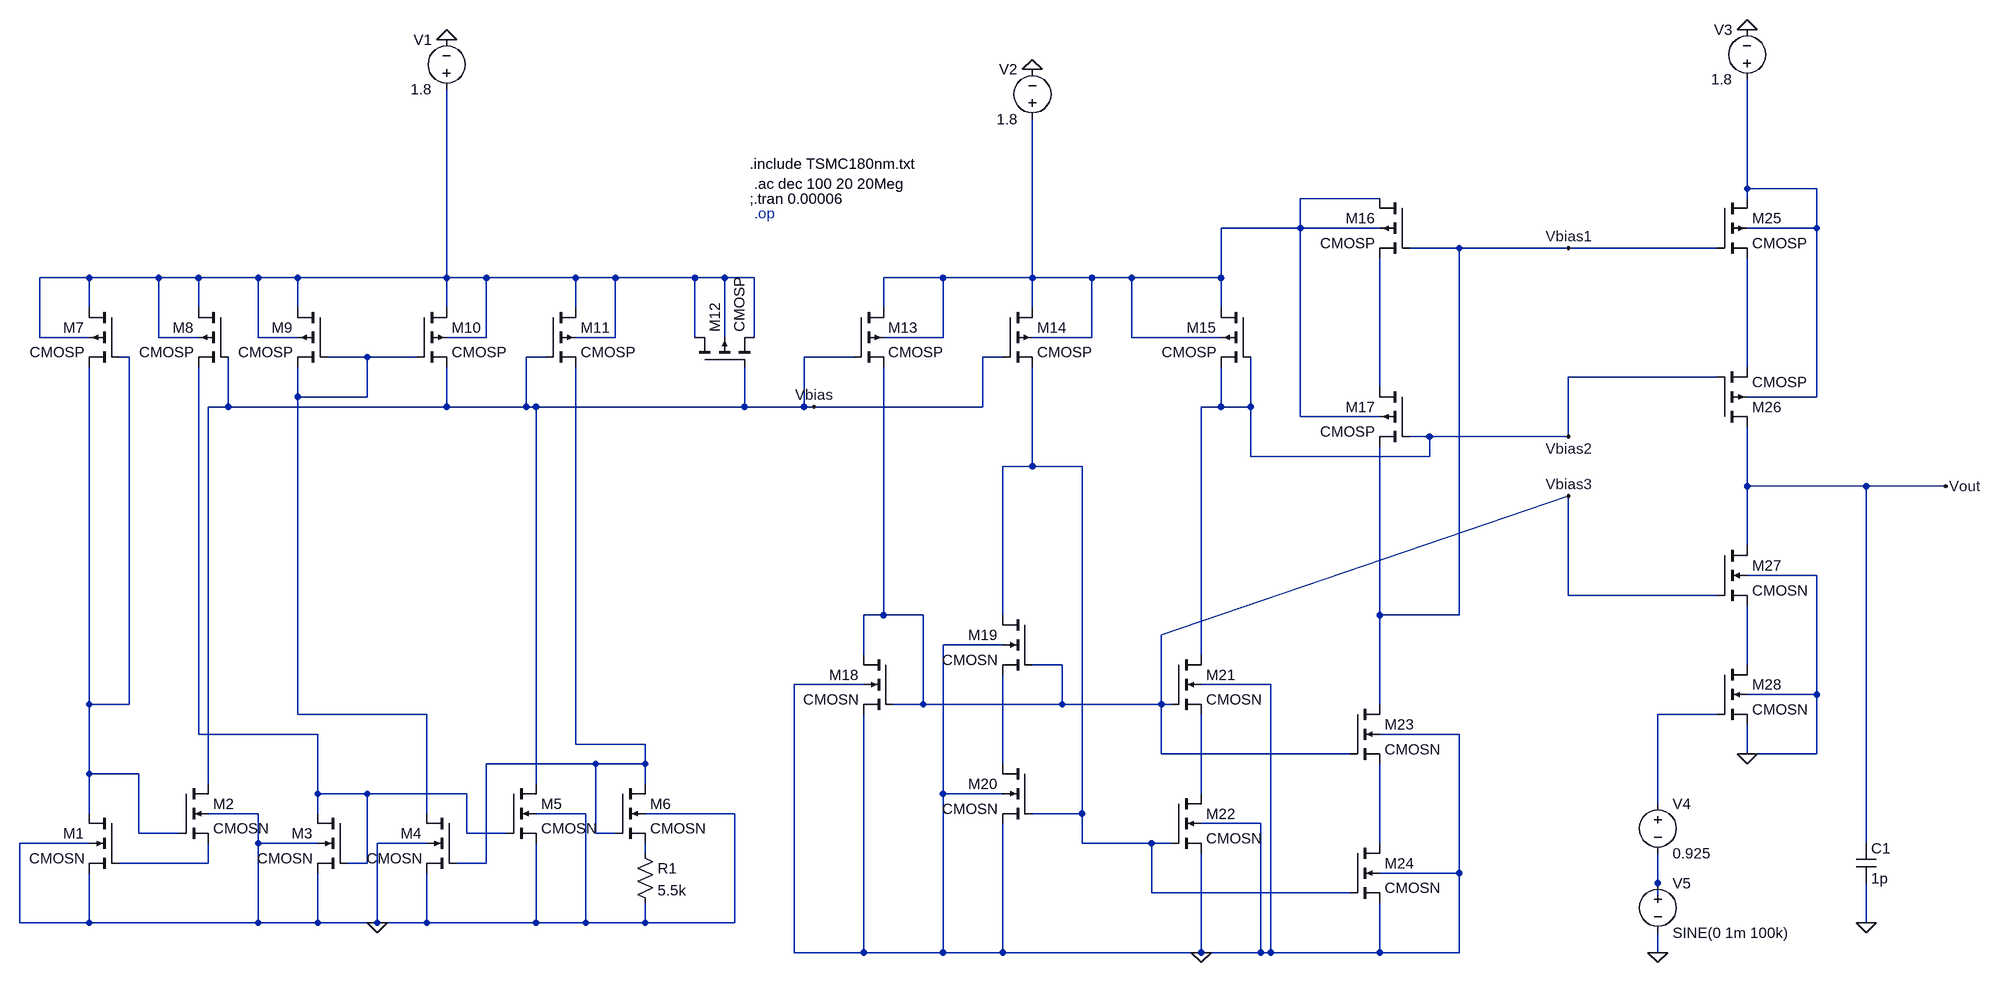
[diagram p0: schematic 180nm_aman2.asc]
180nm_aman2.asc, the LTspice schematic file:
Version 4
SHEET 1 3492 1012
WIRE 2736 -368 2736 -544
WIRE 2848 -368 2736 -368
WIRE 2144 -352 2016 -352
WIRE 2736 -352 2736 -368
WIRE 2016 -304 2016 -352
WIRE 2016 -304 1888 -304
WIRE 2144 -304 2016 -304
WIRE 2848 -304 2848 -368
WIRE 2848 -304 2736 -304
WIRE 2272 -272 2192 -272
WIRE 2448 -272 2272 -272
WIRE 2688 -272 2448 -272
WIRE 64 -224 -16 -224
WIRE 176 -224 64 -224
WIRE 240 -224 176 -224
WIRE 336 -224 240 -224
WIRE 400 -224 336 -224
WIRE 640 -224 640 -528
WIRE 640 -224 400 -224
WIRE 704 -224 640 -224
WIRE 848 -224 704 -224
WIRE 912 -224 848 -224
WIRE 1040 -224 912 -224
WIRE 1088 -224 1040 -224
WIRE 1136 -224 1088 -224
WIRE 1440 -224 1344 -224
WIRE 1584 -224 1584 -480
WIRE 1584 -224 1440 -224
WIRE 1680 -224 1584 -224
WIRE 1744 -224 1680 -224
WIRE 1888 -224 1888 -304
WIRE 1888 -224 1744 -224
WIRE 64 -176 64 -224
WIRE 240 -176 240 -224
WIRE 400 -176 400 -224
WIRE 640 -176 640 -224
WIRE 848 -176 848 -224
WIRE 1344 -176 1344 -224
WIRE 1584 -176 1584 -224
WIRE 1888 -176 1888 -224
WIRE -16 -128 -16 -224
WIRE 64 -128 -16 -128
WIRE 176 -128 176 -224
WIRE 240 -128 176 -128
WIRE 336 -128 336 -224
WIRE 400 -128 336 -128
WIRE 704 -128 704 -224
WIRE 704 -128 640 -128
WIRE 912 -128 912 -224
WIRE 912 -128 848 -128
WIRE 1040 -128 1040 -224
WIRE 1088 -128 1088 -224
WIRE 1136 -128 1136 -224
WIRE 1440 -128 1440 -224
WIRE 1440 -128 1344 -128
WIRE 1680 -128 1680 -224
WIRE 1680 -128 1584 -128
WIRE 1744 -128 1744 -224
WIRE 1888 -128 1744 -128
WIRE 128 -96 112 -96
WIRE 512 -96 448 -96
WIRE 592 -96 512 -96
WIRE 800 -96 768 -96
WIRE 1296 -96 1216 -96
WIRE 1536 -96 1504 -96
WIRE 2736 -80 2736 -256
WIRE 2688 -64 2448 -64
WIRE 2144 -48 2144 -256
WIRE 400 -32 400 -80
WIRE 512 -32 512 -96
WIRE 512 -32 400 -32
WIRE 2848 -32 2848 -304
WIRE 2848 -32 2736 -32
WIRE 288 -16 288 -96
WIRE 288 -16 256 -16
WIRE 640 -16 640 -80
WIRE 640 -16 288 -16
WIRE 768 -16 768 -96
WIRE 768 -16 640 -16
WIRE 784 -16 768 -16
WIRE 1120 -16 1120 -80
WIRE 1120 -16 784 -16
WIRE 1216 -16 1216 -96
WIRE 1216 -16 1120 -16
WIRE 1232 -16 1216 -16
WIRE 1504 -16 1504 -96
WIRE 1504 -16 1232 -16
WIRE 1888 -16 1888 -80
WIRE 1888 -16 1856 -16
WIRE 1936 -16 1936 -96
WIRE 1936 -16 1888 -16
WIRE 2016 0 2016 -304
WIRE 2144 0 2016 0
WIRE 2224 32 2192 32
WIRE 2448 32 2448 -64
WIRE 2448 32 2224 32
WIRE 1936 64 1936 -16
WIRE 2224 64 2224 32
WIRE 2224 64 1936 64
WIRE 1584 80 1584 -80
WIRE 1584 80 1536 80
WIRE 1664 80 1584 80
WIRE 2736 112 2736 16
WIRE 2928 112 2736 112
WIRE 3056 112 2928 112
WIRE 2736 208 2736 112
WIRE 2848 256 2736 256
WIRE 2448 288 2448 128
WIRE 2688 288 2448 288
WIRE 1344 320 1344 -80
WIRE 1344 320 1312 320
WIRE 1408 320 1344 320
WIRE 1536 320 1536 80
WIRE 2144 320 2144 48
WIRE 2272 320 2272 -272
WIRE 2272 320 2144 320
WIRE 1792 352 2448 128
WIRE 1536 368 1440 368
WIRE 1312 384 1312 320
WIRE 1856 384 1856 -16
WIRE 1632 400 1584 400
WIRE 2736 400 2736 304
WIRE 1312 432 1200 432
WIRE 1968 432 1856 432
WIRE 2848 448 2848 256
WIRE 2848 448 2736 448
WIRE 64 464 64 -80
WIRE 128 464 128 -96
WIRE 128 464 64 464
WIRE 1408 464 1408 320
WIRE 1408 464 1360 464
WIRE 1632 464 1632 400
WIRE 1632 464 1408 464
WIRE 1792 464 1792 352
WIRE 1792 464 1632 464
WIRE 1808 464 1792 464
WIRE 2144 464 2144 320
WIRE 400 480 400 -32
WIRE 608 480 400 480
WIRE 2688 480 2592 480
WIRE 240 512 240 -80
WIRE 432 512 240 512
WIRE 2272 512 2144 512
WIRE 848 528 848 -80
WIRE 960 528 848 528
WIRE 1792 544 1792 464
WIRE 2096 544 1792 544
WIRE 2736 544 2736 496
WIRE 2848 544 2848 448
WIRE 2848 544 2736 544
WIRE 880 560 704 560
WIRE 960 560 960 528
WIRE 960 560 880 560
WIRE 1536 560 1536 416
WIRE 64 576 64 464
WIRE 144 576 64 576
WIRE 256 592 256 -16
WIRE 784 592 784 -16
WIRE 960 592 960 560
WIRE 432 608 432 512
WIRE 512 608 432 608
WIRE 672 608 512 608
WIRE 1440 608 1440 368
WIRE 1536 608 1440 608
WIRE 1856 608 1856 480
WIRE 2592 624 2592 480
WIRE 64 640 64 576
WIRE 336 640 256 640
WIRE 432 640 432 608
WIRE 608 640 608 480
WIRE 864 640 784 640
WIRE 1104 640 960 640
WIRE 1664 640 1664 80
WIRE 1664 640 1584 640
WIRE 1952 656 1856 656
WIRE 144 672 144 576
WIRE 208 672 144 672
WIRE 672 672 672 608
WIRE 736 672 672 672
WIRE 880 672 880 560
WIRE 912 672 880 672
WIRE 64 688 -48 688
WIRE 336 688 336 640
WIRE 432 688 336 688
WIRE 608 688 528 688
WIRE 1664 688 1664 640
WIRE 1776 688 1664 688
WIRE 1808 688 1776 688
WIRE 2144 688 2144 560
WIRE 2928 688 2928 112
WIRE 960 704 960 688
WIRE 256 720 256 688
WIRE 256 720 112 720
WIRE 512 720 512 608
WIRE 512 720 480 720
WIRE 704 720 704 560
WIRE 704 720 656 720
WIRE 2272 736 2272 512
WIRE 2272 736 2144 736
WIRE 2592 752 2592 704
WIRE 1776 768 1776 688
WIRE 2096 768 1776 768
WIRE 2592 784 2592 752
WIRE -48 816 -48 688
WIRE 64 816 64 736
WIRE 64 816 -48 816
WIRE 336 816 336 688
WIRE 336 816 64 816
WIRE 432 816 432 736
WIRE 432 816 336 816
WIRE 528 816 528 688
WIRE 528 816 432 816
WIRE 608 816 608 736
WIRE 608 816 528 816
WIRE 784 816 784 688
WIRE 784 816 608 816
WIRE 864 816 864 640
WIRE 864 816 784 816
WIRE 960 816 960 784
WIRE 960 816 864 816
WIRE 1104 816 1104 640
WIRE 1104 816 960 816
WIRE 2928 816 2928 752
WIRE 1200 864 1200 432
WIRE 1312 864 1312 480
WIRE 1312 864 1200 864
WIRE 1440 864 1440 608
WIRE 1440 864 1312 864
WIRE 1536 864 1536 656
WIRE 1536 864 1440 864
WIRE 1856 864 1856 704
WIRE 1856 864 1536 864
WIRE 1952 864 1952 656
WIRE 1952 864 1856 864
WIRE 1968 864 1968 432
WIRE 1968 864 1952 864
WIRE 2144 864 2144 784
WIRE 2144 864 1968 864
WIRE 2272 864 2272 736
WIRE 2272 864 2144 864
WIRE 2592 864 2592 832
FLAG 528 816 0
FLAG 640 -608 0
FLAG 1232 -16 Vbias
FLAG 1856 864 0
FLAG 1584 -560 0
FLAG 2448 -272 Vbias1
FLAG 2448 32 Vbias2
FLAG 2448 128 Vbias3
FLAG 2592 864 0
FLAG 2736 544 0
FLAG 2736 -624 0
FLAG 2928 816 0
FLAG 3056 112 Vout
SYMBOL nmos4 112 640 M0
SYMATTR InstName M1
SYMATTR Value CMOSN
SYMATTR Value2 l=0.36u w=1.8u
SYMBOL nmos4 208 592 R0
SYMATTR InstName M2
SYMATTR Value CMOSN
SYMATTR Value2 l=0.36u w=0.72u
SYMBOL nmos4 480 640 M0
SYMATTR InstName M3
SYMATTR Value CMOSN
SYMATTR Value2 l=0.36u w=1.8u
SYMBOL nmos4 656 640 M0
SYMATTR InstName M4
SYMATTR Value CMOSN
SYMATTR Value2 l=0.36u w=1.8u
SYMBOL nmos4 736 592 R0
SYMATTR InstName M5
SYMATTR Value CMOSN
SYMATTR Value2 l=0.36u w=1.8u
SYMBOL nmos4 912 592 R0
SYMATTR InstName M6
SYMATTR Value CMOSN
SYMATTR Value2 l=0.36u w=5.4u
SYMBOL pmos4 112 -176 M0
SYMATTR InstName M7
SYMATTR Value CMOSP
SYMATTR Value2 l=3.6u w=1.8u
SYMBOL pmos4 288 -176 M0
SYMATTR InstName M8
SYMATTR Value CMOSP
SYMATTR Value2 l=0.36u w=4.32u
SYMBOL pmos4 448 -176 M0
SYMATTR InstName M9
SYMATTR Value CMOSP
SYMATTR Value2 l=0.36u w=4.32u
SYMBOL pmos4 592 -176 R0
SYMATTR InstName M10
SYMATTR Value CMOSP
SYMATTR Value2 l=0.36u w=4.32u
SYMBOL pmos4 800 -176 R0
SYMATTR InstName M11
SYMATTR Value CMOSP
SYMATTR Value2 l=0.36u w=4.32u
SYMBOL pmos4 1040 -80 R270
SYMATTR InstName M12
SYMATTR Value CMOSP
SYMATTR Value2 l=9u w=9u
SYMBOL res 944 688 R0
SYMATTR InstName R1
SYMATTR Value 5.5k
SYMBOL voltage 640 -512 R180
WINDOW 0 24 96 Left 2
WINDOW 3 24 16 Left 2
WINDOW 123 0 0 Left 0
WINDOW 39 0 0 Left 0
SYMATTR InstName V1
SYMATTR Value 1.8
SYMBOL pmos4 1296 -176 R0
SYMATTR InstName M13
SYMATTR Value CMOSP
SYMATTR Value2 l=0.36u w=4.32u
SYMBOL pmos4 1536 -176 R0
SYMATTR InstName M14
SYMATTR Value CMOSP
SYMATTR Value2 l=0.36u w=4.32u
SYMBOL pmos4 1936 -176 M0
SYMATTR InstName M15
SYMATTR Value CMOSP
SYMATTR Value2 l=3.78u w=1.98u
SYMBOL pmos4 2192 -352 M0
SYMATTR InstName M16
SYMATTR Value CMOSP
SYMATTR Value2 l=3.6u w=5.04u
SYMBOL pmos4 2192 -48 M0
SYMATTR InstName M17
SYMATTR Value CMOSP
SYMATTR Value2 l=0.36u w=4.32u
SYMBOL nmos4 1360 384 M0
SYMATTR InstName M18
SYMATTR Value CMOSN
SYMATTR Value2 l=2.7u w=0.18u
SYMBOL nmos4 1584 320 M0
SYMATTR InstName M19
SYMATTR Value CMOSN
SYMATTR Value2 l=0.36u w=1.8u
SYMBOL nmos4 1584 560 M0
SYMATTR InstName M20
SYMATTR Value CMOSN
SYMATTR Value2 l=0.36u w=1.8u
SYMBOL nmos4 1808 384 R0
SYMATTR InstName M21
SYMATTR Value CMOSN
SYMATTR Value2 l=0.36u w=1.8u
SYMBOL nmos4 1808 608 R0
SYMATTR InstName M22
SYMATTR Value CMOSN
SYMATTR Value2 l=0.36u w=1.8u
SYMBOL nmos4 2096 464 R0
SYMATTR InstName M23
SYMATTR Value CMOSN
SYMATTR Value2 l=0.36u w=1.8u
SYMBOL nmos4 2096 688 R0
SYMATTR InstName M24
SYMATTR Value CMOSN
SYMATTR Value2 l=0.36u w=1.8u
SYMBOL voltage 1584 -464 R180
WINDOW 0 24 96 Left 2
WINDOW 3 24 16 Left 2
WINDOW 123 0 0 Left 0
WINDOW 39 0 0 Left 0
SYMATTR InstName V2
SYMATTR Value 1.8
SYMBOL pmos4 2688 -352 R0
SYMATTR InstName M25
SYMATTR Value CMOSP
SYMATTR Value2 l=0.18u w=6.130u
SYMBOL pmos4 2688 16 M180
SYMATTR InstName M26
SYMATTR Value CMOSP
SYMATTR Value2 l=0.18u w=6.130u
SYMBOL nmos4 2688 208 R0
SYMATTR InstName M27
SYMATTR Value CMOSN
SYMATTR Value2 l=0.18u w=1.223u
SYMBOL nmos4 2688 400 R0
SYMATTR InstName M28
SYMATTR Value CMOSN
SYMATTR Value2 l=0.18u w=1.223u
SYMBOL voltage 2592 608 R0
WINDOW 123 0 0 Left 0
WINDOW 39 0 0 Left 0
SYMATTR InstName V4
SYMATTR Value 0.925
SYMBOL voltage 2592 736 R0
WINDOW 39 0 0 Left 0
SYMATTR Value2 AC 4
SYMATTR InstName V5
SYMATTR Value SINE(0 1m 100k)
SYMBOL voltage 2736 -528 R180
WINDOW 0 24 96 Left 2
WINDOW 3 24 16 Left 2
WINDOW 123 0 0 Left 0
WINDOW 39 0 0 Left 0
SYMATTR InstName V3
SYMATTR Value 1.8
SYMBOL cap 2912 688 R0
SYMATTR InstName C1
SYMATTR Value 1p
TEXT 1128 -408 Left 2 !.include TSMC180nm.txt
TEXT 1136 -376 Left 2 !.ac dec 100 20 20Meg
TEXT 1128 -352 Left 2 !;.tran 0.00006
TEXT 1136 -328 Left 2 ;.op

The netlist it stands for:
* 180nm_aman2.asc
M1 N004 N017 0 0 CMOSN l=0.36u w=1.8u
M2 Vbias N004 N017 0 CMOSN l=0.36u w=0.72u
M3 N011 N011 0 0 CMOSN l=0.36u w=1.8u
M4 N005 N012 0 0 CMOSN l=0.36u w=1.8u
M5 Vbias N011 0 0 CMOSN l=0.36u w=1.8u
M6 N012 N012 N016 0 CMOSN l=0.36u w=5.4u
M7 N003 N004 N004 N003 CMOSP l=3.6u w=1.8u
M8 N003 Vbias N011 N003 CMOSP l=0.36u w=4.32u
M9 N003 N005 N005 N003 CMOSP l=0.36u w=4.32u
M10 N003 N005 Vbias N003 CMOSP l=0.36u w=4.32u
M11 N003 Vbias N012 N003 CMOSP l=0.36u w=4.32u
M12 N003 Vbias N003 N003 CMOSP l=9u w=9u
R1 N016 0 5.5k
V1 N003 0 1.8
M13 N002 Vbias Vbias3 N002 CMOSP l=0.36u w=4.32u
M14 N002 Vbias N008 N002 CMOSP l=0.36u w=4.32u
M15 N002 Vbias2 Vbias2 N002 CMOSP l=3.78u w=1.98u
M16 N002 Vbias1 N007 N002 CMOSP l=3.6u w=5.04u
M17 N007 Vbias2 Vbias1 N002 CMOSP l=0.36u w=4.32u
M18 Vbias3 Vbias3 0 0 CMOSN l=2.7u w=0.18u
M19 N008 Vbias3 N013 0 CMOSN l=0.36u w=1.8u
M20 N013 N008 0 0 CMOSN l=0.36u w=1.8u
M21 Vbias2 Vbias3 N014 0 CMOSN l=0.36u w=1.8u
M22 N014 N008 0 0 CMOSN l=0.36u w=1.8u
M23 Vbias1 Vbias3 N015 0 CMOSN l=0.36u w=1.8u
M24 N015 N008 0 0 CMOSN l=0.36u w=1.8u
V2 N002 0 1.8
M25 N001 Vbias1 N006 N001 CMOSP l=0.18u w=6.130u
M26 Vout Vbias2 N006 N001 CMOSP l=0.18u w=6.130u
M27 Vout Vbias3 N009 0 CMOSN l=0.18u w=1.223u
M28 N009 N010 0 0 CMOSN l=0.18u w=1.223u
V4 N010 N018 0.925
V5 N018 0 SINE(0 1m 100k) AC 4
V3 N001 0 1.8
C1 Vout 0 1p
.model NMOS NMOS
.model PMOS PMOS
.lib standard.mos
.include TSMC180nm.txt
.ac dec 100 20 20Meg
;.tran 0.00006
* .op
.backanno
.end